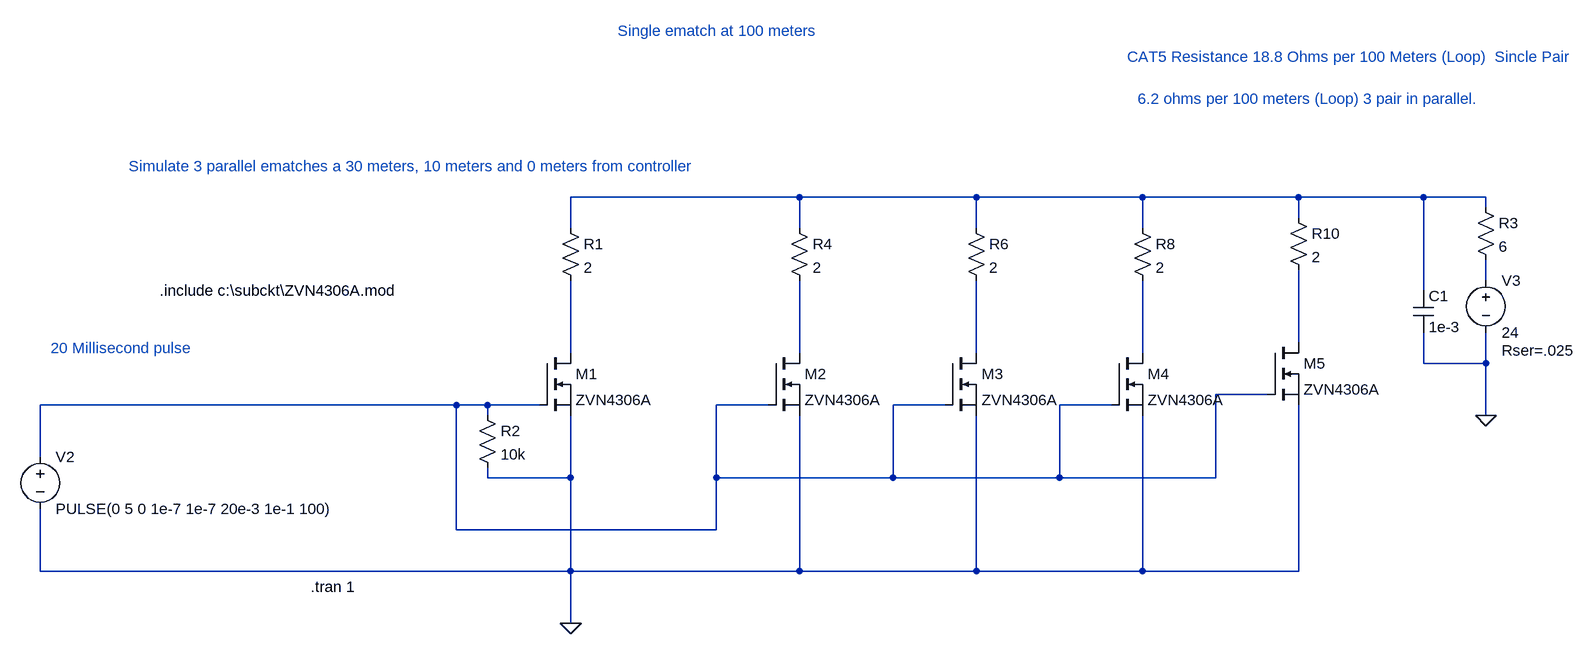
[diagram p0: schematic 5 simultaneous ematch , 100 meters.asc]
5 simultaneous ematch , 100 meters.asc, the LTspice schematic file:
Version 4
SHEET 1 1824 900
WIRE 512 -96 160 -96
WIRE 784 -96 512 -96
WIRE 1040 -96 784 -96
WIRE 1280 -96 1040 -96
WIRE 1472 -96 1280 -96
WIRE 1568 -96 1472 -96
WIRE 1568 -80 1568 -96
WIRE 1280 -64 1280 -96
WIRE 160 -48 160 -96
WIRE 512 -48 512 -96
WIRE 784 -48 784 -96
WIRE 1040 -48 1040 -96
WIRE 1568 32 1568 0
WIRE 1472 48 1472 -96
WIRE 1280 128 1280 16
WIRE 160 144 160 32
WIRE 512 144 512 32
WIRE 784 144 784 32
WIRE 1040 144 1040 32
WIRE 1472 160 1472 112
WIRE 1568 160 1568 112
WIRE 1568 160 1472 160
WIRE 1232 208 1152 208
WIRE -16 224 -656 224
WIRE 32 224 -16 224
WIRE 112 224 32 224
WIRE 464 224 384 224
WIRE 736 224 656 224
WIRE 992 224 912 224
WIRE 32 240 32 224
WIRE 1568 240 1568 160
WIRE -656 304 -656 224
WIRE 32 336 32 320
WIRE 160 336 160 240
WIRE 160 336 32 336
WIRE 384 336 384 224
WIRE 656 336 656 224
WIRE 656 336 384 336
WIRE 912 336 912 224
WIRE 912 336 656 336
WIRE 1152 336 1152 208
WIRE 1152 336 912 336
WIRE -16 416 -16 224
WIRE 384 416 384 336
WIRE 384 416 -16 416
WIRE -656 480 -656 384
WIRE 160 480 160 336
WIRE 160 480 -656 480
WIRE 512 480 512 240
WIRE 512 480 160 480
WIRE 784 480 784 240
WIRE 784 480 512 480
WIRE 1040 480 1040 240
WIRE 1040 480 784 480
WIRE 1280 480 1280 224
WIRE 1280 480 1040 480
WIRE 160 560 160 480
FLAG 160 560 0
FLAG 1568 240 0
SYMBOL nmos 112 144 R0
SYMATTR InstName M1
SYMATTR Value ZVN4306A
SYMATTR Prefix X
SYMBOL res 144 -64 R0
SYMATTR InstName R1
SYMATTR Value 2
SYMBOL res 16 224 R0
SYMATTR InstName R2
SYMATTR Value 10k
SYMBOL voltage -656 288 R0
WINDOW 123 0 0 Left 2
WINDOW 39 24 124 Left 2
SYMATTR InstName V2
SYMATTR Value PULSE(0 5 0 1e-7 1e-7 20e-3 1e-1 100)
SYMBOL voltage 1568 16 R0
WINDOW 123 0 0 Left 2
WINDOW 39 24 124 Left 2
SYMATTR SpiceLine Rser=.025
SYMATTR InstName V3
SYMATTR Value 24
SYMBOL res 1552 -96 R0
SYMATTR InstName R3
SYMATTR Value 6
SYMBOL nmos 464 144 R0
SYMATTR InstName M2
SYMATTR Value ZVN4306A
SYMATTR Prefix X
SYMBOL res 496 -64 R0
SYMATTR InstName R4
SYMATTR Value 2
SYMBOL nmos 736 144 R0
SYMATTR InstName M3
SYMATTR Value ZVN4306A
SYMATTR Prefix X
SYMBOL res 768 -64 R0
SYMATTR InstName R6
SYMATTR Value 2
SYMBOL nmos 992 144 R0
SYMATTR InstName M4
SYMATTR Value ZVN4306A
SYMATTR Prefix X
SYMBOL res 1024 -64 R0
SYMATTR InstName R8
SYMATTR Value 2
SYMBOL nmos 1232 128 R0
SYMATTR InstName M5
SYMATTR Value ZVN4306A
SYMATTR Prefix X
SYMBOL res 1264 -80 R0
SYMATTR InstName R10
SYMATTR Value 2
SYMBOL cap 1456 48 R0
SYMATTR InstName C1
SYMATTR Value 1e-3
TEXT -240 504 Left 2 !.tran 1
TEXT 232 -352 Left 2 ;Single ematch at 100 meters
TEXT -472 48 Left 2 !.include c:\\subckt\\ZVN4306A.mod
TEXT 1016 -312 Left 2 ;CAT5 Resistance 18.8 Ohms per 100 Meters (Loop)  Sincle Pair
TEXT 1032 -248 Left 2 ;6.2 ohms per 100 meters (Loop) 3 pair in parallel.
TEXT -640 136 Left 2 ;20 Millisecond pulse
TEXT -520 -144 Left 2 ;Simulate 3 parallel ematches a 30 meters, 10 meters and 0 meters from controller

The netlist it stands for:
* 5 simultaneous ematch , 100 meters.asc
XM1 N004 N008 0 ZVN4306A  ; pins D G S
R1 N001 N004 2
R2 N008 0 10k
V2 N008 0 PULSE(0 5 0 1e-7 1e-7 20e-3 1e-1 100)
V3 N002 0 24 Rser=.025
R3 N001 N002 6
XM2 N005 N008 0 ZVN4306A  ; pins D G S
R4 N001 N005 2
XM3 N006 N008 0 ZVN4306A  ; pins D G S
R6 N001 N006 2
XM4 N007 N008 0 ZVN4306A  ; pins D G S
R8 N001 N007 2
XM5 N003 N008 0 ZVN4306A  ; pins D G S
R10 N001 N003 2
C1 N001 0 1e-3
.tran 1
* Single ematch at 100 meters
.include c:\subckt\ZVN4306A.mod
* CAT5 Resistance 18.8 Ohms per 100 Meters (Loop)  Sincle Pair
* 6.2 ohms per 100 meters (Loop) 3 pair in parallel.
* 20 Millisecond pulse
* Simulate 3 parallel ematches a 30 meters, 10 meters and 0 meters from controller
.backanno
.end